# Altium schematic sheet MR_RangeSensor.SchDoc
size A4; CompanyName: BeeIonic; SheetNumber: 6; SheetTotal: 7
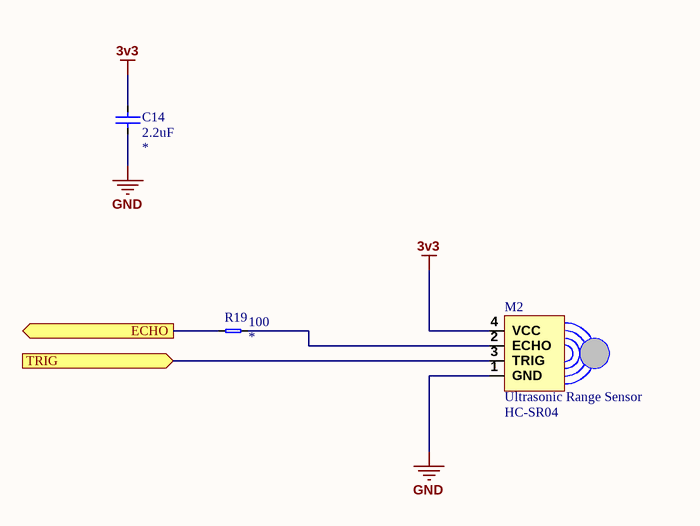
[diagram p0: MR_RangeSensor.SchDoc]

## Parts
C14  value 2.2uF  [0603_CAP_LD]  (hidden comment: CerCap)
M2  Ultrasonic Range Sensor  [HC-SR04]
R19  value 100  [0603_RES_LD]  (hidden comment: Resistor)

## Ports
ECHO (out), TRIG (in)

## Nets
3v3: C14.2 M2.4(VCC)
GND: C14.1 M2.1(GND)
ECHO: R19.1 ; port ECHO
TRIG: M2.3(TRIG) ; port TRIG
NetM2_2: M2.2(ECHO) R19.2

## Notes on the sheet
- Project :
- Title :
- Sheet:
- of
- Creation Date :
- Designer :
- Modified Date :

## Library data of the parts
C14 = CerCap: Ceramic Capacitor; Type: *; Voltage/Power: *; Package: *
M2 = HC-SR04: Reference: HC-SR04
R19 = Resistor: Precision: *; Package: *